# Altium schematic sheet ADC.SchDoc
size A4
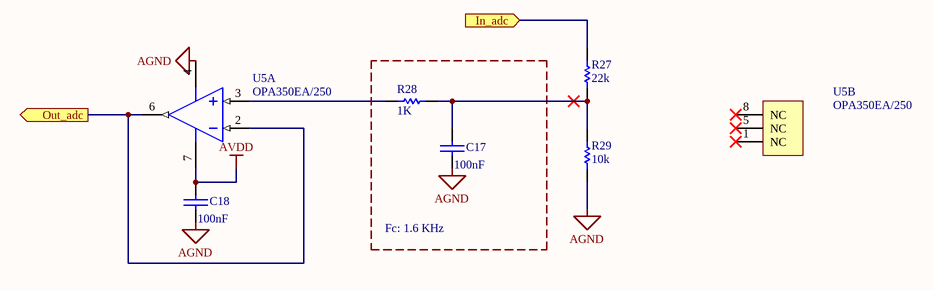
[diagram p0: ADC.SchDoc]

## Parts
C17  100nF  [0603C]
C18  100nF  [0603C]
R27  22k  [0603R]
R28  1K  [0603R]
R29  10k  [0603R]
U5  OPA350EA/250  [DGK0008A_M]  (parts A,B of 2)

## Blocks framed on the sheet
Fc: 1.6 KHz: C17 R28

## Ports
In_adc (in), Out_adc (out)

## Nets
AGND: C17.2 C18.2 R29.1 U5.4(V-)
AVDD: C18.1 U5.7(V+)
In_adc: R27.2 ; port In_adc
Out_adc: U5.2(IN-) U5.6(OUT) ; port Out_adc
NetC17_1: C17.1 R27.1 R28.1 R29.2
NetR28_2: R28.2 U5.3(IN+)

Not connected (* = marked no-connect by the designer): U5 1(NC)* 5(NC)* 8(NC)*

## Library data of the parts
C17 C18 = CAP: Capacitor
R27 R28 = Resistor_ST: Resistor 0402 / 0603 / 0805; Value: 10K
R29 = Resistor_ST: Resistor 0402 / 0603 / 0805; Value: 10K
U5 = CMP-0272-01143-3: High-Speed, Single-Supply, Rail-to-Rail Operational Amplifier MicroAmplifier(TM) Series, 2.7 to 5.5 V, -40 to 85 degC, 8-pin SOP (DGK8), Green (RoHS & no Sb/Br); Manufacturer: Texas Instruments; Iq per channel(Max)(mA): 8.5; Number of Channels: 1; Vn at 1kHz(Typ)(nV/rtHz): 18; Offset Drift(Typ)(uV/C): 4; IIB(Max)(pA): 10; Total Supply Voltage(Max)(+5V is 5, +/-5V is 10): 5.5; CMRR(Min)(dB): 66; Sub Family: Low Input Bias Current Amp (<=10pA), Low Offset Voltage Amplifier (<=500uV), Low Supply Voltage Amplifier (<=2.7V), Precision Amplifier; Slew Rate(Typ)(V/us): 22; Total Supply Voltage(Min)(+5V is 5, +/-5V is 10): 2.7; Mounting Technology: Surface Mount; ComponentLink1Description: Manufacturer URL; ComponentLink2Description: Datasheet; PackageReference: DGK0008A; ComponentLink1URL: http://www.ti.com/; Vio (25C)(Max)(mV): 1; ComponentLink2URL: http://www.ti.com/general/docs/lit/getliterature.tsp?genericPartNumber=OPA350&fileType=pdf; ComponentLink3Description: Package Specification; PackageDescription: 8-Pin Thin Small Outline, Body 3 x 3 mm, Pitch 0.65 mm; DatasheetVersion: SBOS099C; Code_JEDEC: MO-187; Eco-Plan: Green (RoHS & no Sb/Br); PackageVersion: 4073329/E, 05/2006; ComponentLink3URL: http://www.ti.com/litv/pdf/mpds028d; PartNumber: OPA350EA/250